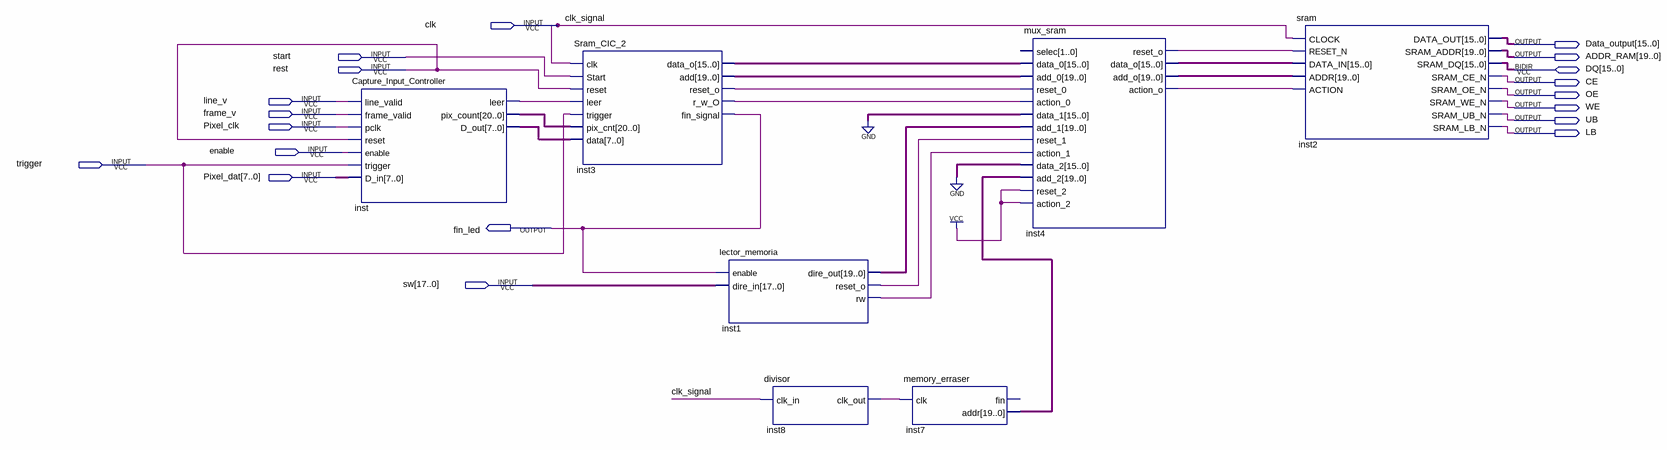
[diagram p0: schematic sheet]
// Quartus schematic CIC_SRAM_BLOCK.bdf as structural Verilog: 7 symbols, 19 pins
module CIC_SRAM_BLOCK (
  input  clk,
  input  start,
  input  rest,
  input  line_v,
  input  frame_v,
  input  Pixel_clk,
  input  enable,
  input  trigger,
  input  [7:0] Pixel_dat,
  input  [17:0] sw,
  inout  [15:0] DQ,
  output [15:0] Data_output,
  output [19:0] ADDR_RAM,
  output CE,
  output OE,
  output WE,
  output UB,
  output LB,
  output fin_led
);

  wire inst1_reset_o, inst1_rw, inst3_r_w_o, inst3_reset_o, inst4_action_o, inst4_reset_o, inst8_clk_out,
       inst_leer;
  wire [7:0] inst_d_out;
  wire [15:0] inst3_data_o, inst4_data_o;
  wire [19:0] inst1_dire_out, inst3_add, inst4_add_o, inst7_addr;
  wire [20:0] inst_pix_count;

  Capture_Input_Controller inst (
    .line_valid(line_v), .frame_valid(frame_v), .pclk(Pixel_clk), .reset(rest), .enable(enable),
    .trigger(trigger), .D_in(Pixel_dat), .leer(inst_leer), .pix_count(inst_pix_count), .D_out(inst_d_out));
  Sram_CIC_2 inst3 (
    .clk(clk), .Start(start), .reset(rest), .leer(inst_leer), .trigger(trigger), .pix_cnt(inst_pix_count),
    .data(inst_d_out), .data_o(inst3_data_o), .add(inst3_add), .reset_o(inst3_reset_o), .r_w_O(inst3_r_w_o),
    .fin_signal(fin_led));
  lector_memoria inst1 (
    .enable(fin_led), .dire_in(sw), .dire_out(inst1_dire_out), .reset_o(inst1_reset_o), .rw(inst1_rw));
  divisor inst8 (.clk_in(clk), .clk_out(inst8_clk_out));
  memory_erraser inst7 (.clk(inst8_clk_out), .addr(inst7_addr));  // open: fin
  mux_sram inst4 (
    .data_0(inst3_data_o), .add_0(inst3_add), .reset_0(inst3_reset_o), .action_0(inst3_r_w_o),
    .data_1({16{1'b0}}), .add_1(inst1_dire_out), .reset_1(inst1_reset_o), .action_1(inst1_rw),
    .data_2({16{1'b0}}), .add_2(inst7_addr), .reset_2(1'b1), .action_2(1'b1), .reset_o(inst4_reset_o),
    .data_o(inst4_data_o), .add_o(inst4_add_o), .action_o(inst4_action_o));  // open: selec
  sram inst2 (
    .CLOCK(clk), .RESET_N(inst4_reset_o), .DATA_IN(inst4_data_o), .ADDR(inst4_add_o),
    .ACTION(inst4_action_o), .DATA_OUT(Data_output), .SRAM_ADDR(ADDR_RAM), .SRAM_CE_N(CE), .SRAM_OE_N(OE),
    .SRAM_WE_N(WE), .SRAM_UB_N(UB), .SRAM_LB_N(LB), .SRAM_DQ(DQ));

  // Other names for the same wires on the sheet: clk_signal = clk
endmodule
